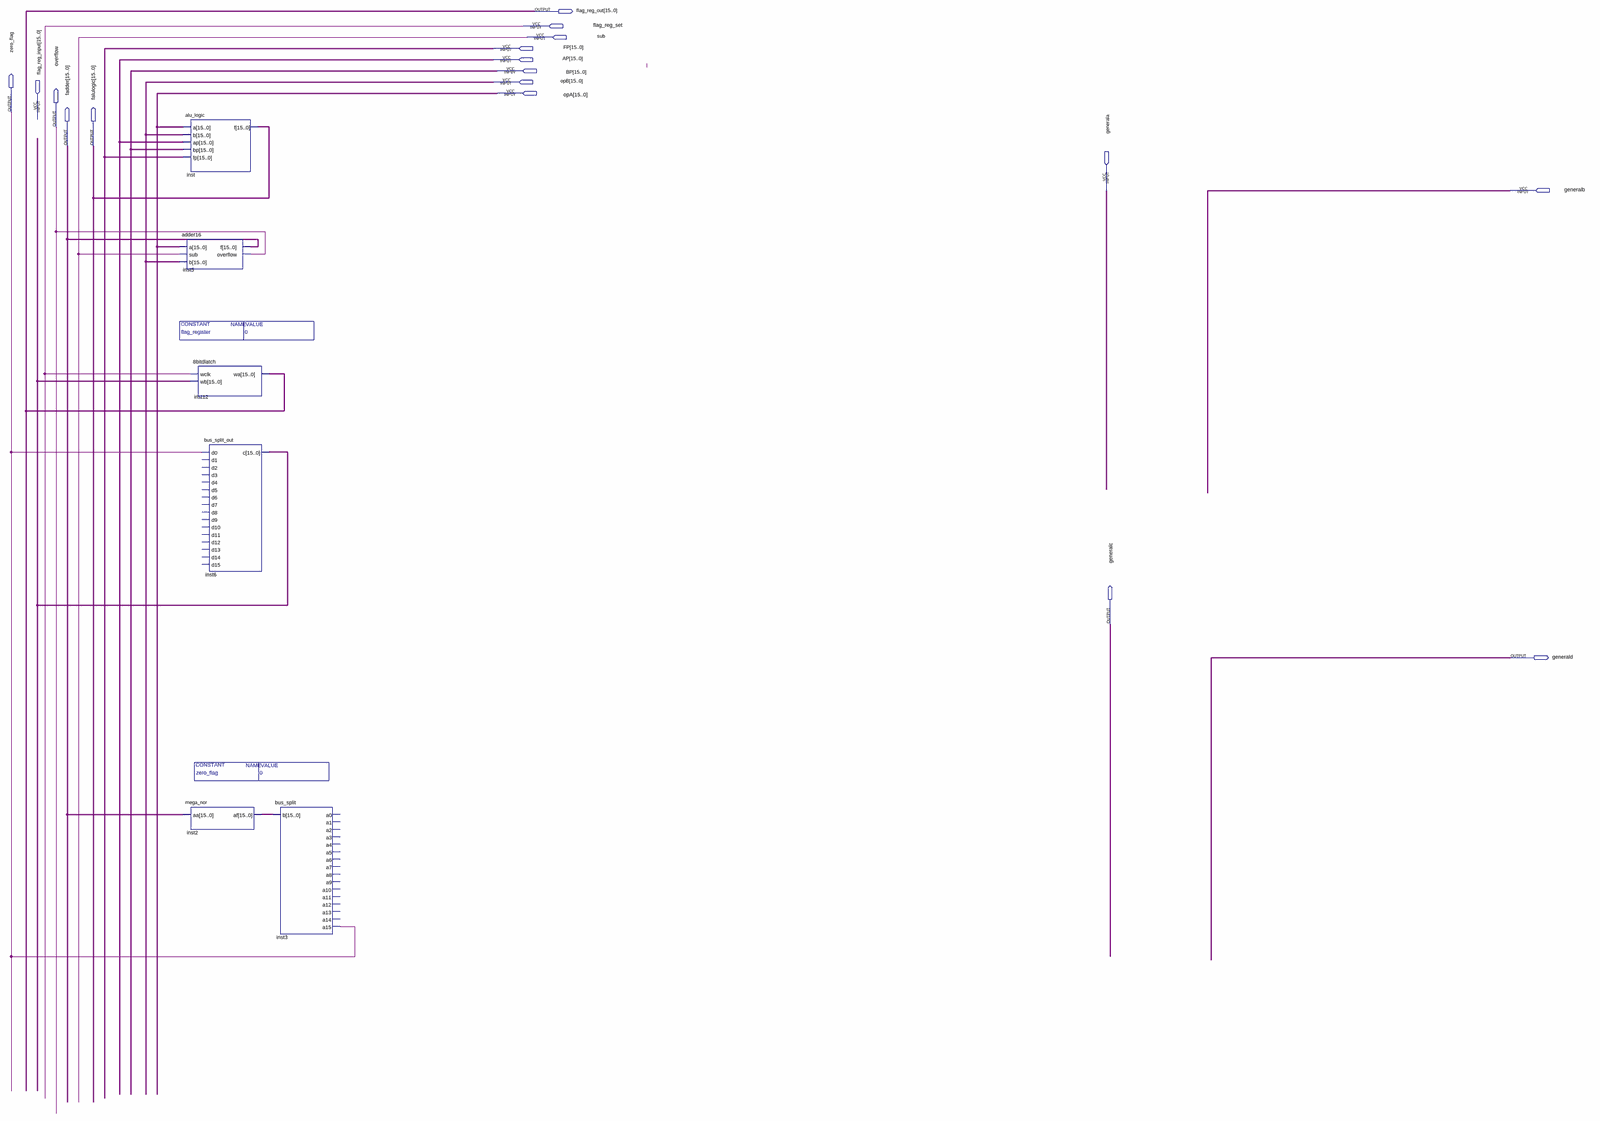
[diagram p0: schematic sheet, whole]
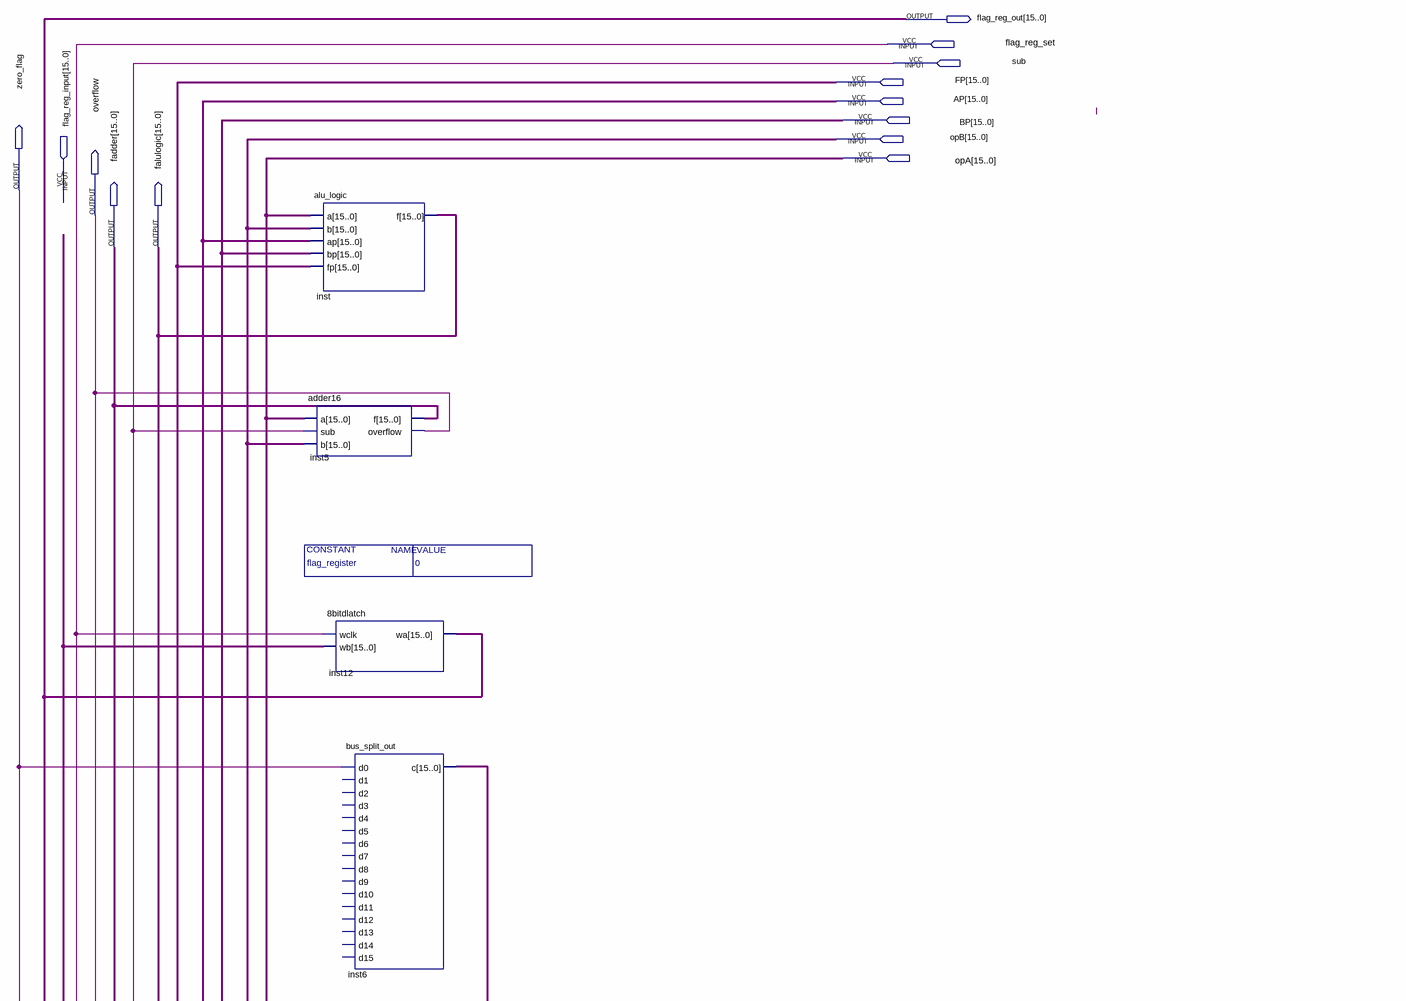
[diagram p1: schematic sheet, upper left part]
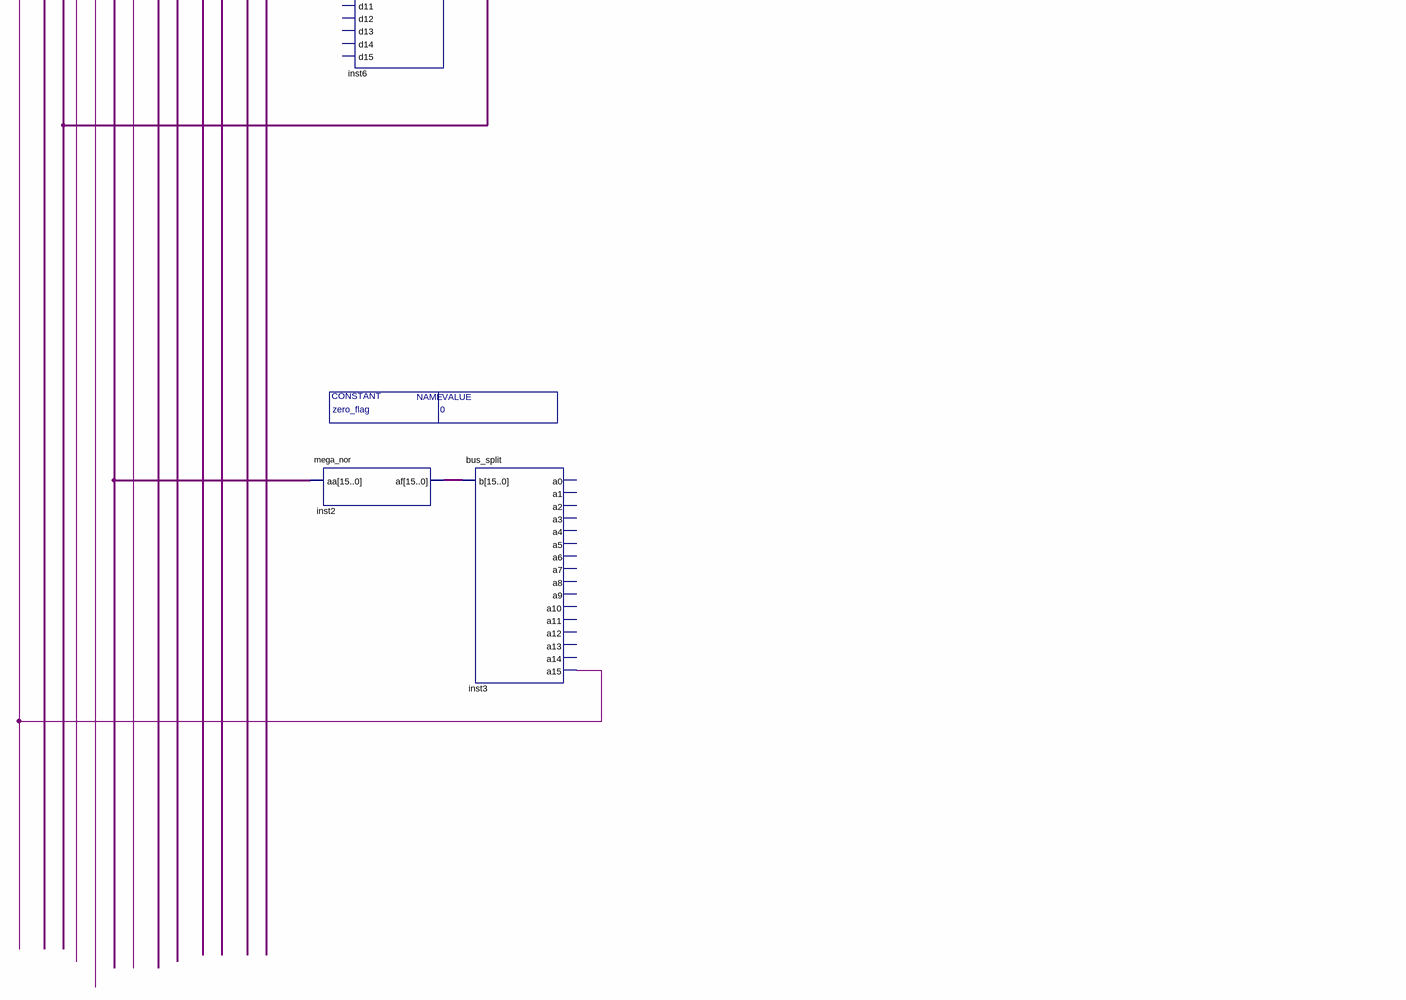
[diagram p2: schematic sheet, lower left part]
// Quartus schematic alumod.bdf as structural Verilog: 6 symbols, 17 pins
module alumod #(parameter flag_register = 0, parameter zero_flag = 0) (
  input  flag_reg_set,
  input  sub,
  input  [15:0] FP,
  input  [15:0] AP,
  input  [15:0] BP,
  input  [15:0] opB,
  input  [15:0] opA,
  input  [15:0] flag_reg_input,
  input  generala,
  input  generalb,
  output [15:0] flag_reg_out,
  output zero_flag,
  output overflow,
  output [15:0] fadder,
  output [15:0] falulogic,
  output generalc,
  output generald
);

  wire [15:0] inst2_af, inst6_c;

  adder16 inst5 (.a(opA), .sub(sub), .b(opB), .f(fadder), .overflow(overflow));
  alu_logic inst (.a(opA), .b(opB), .ap(AP), .bp(BP), .fp(FP), .f(falulogic));
  \8bitdlatch  inst12 (.wclk(flag_reg_set), .wb(inst6_c), .wa(flag_reg_out));
  bus_split_out inst6 (
    .d0(zero_flag), .c(inst6_c));  // open: d1, d2, d3, d4, d5, d6, d7, d8, d9, d10, d11, d12, d13, d14, d15
  mega_nor inst2 (.aa(fadder), .af(inst2_af));
  bus_split inst3 (
    .b(inst2_af), .a15(zero_flag));  // open: a0, a1, a2, a3, a4, a5, a6, a7, a8, a9, a10, a11, a12, a13, a14
endmodule
